# EAGLE design 7seg-micro (EAGLE 7.1.0)
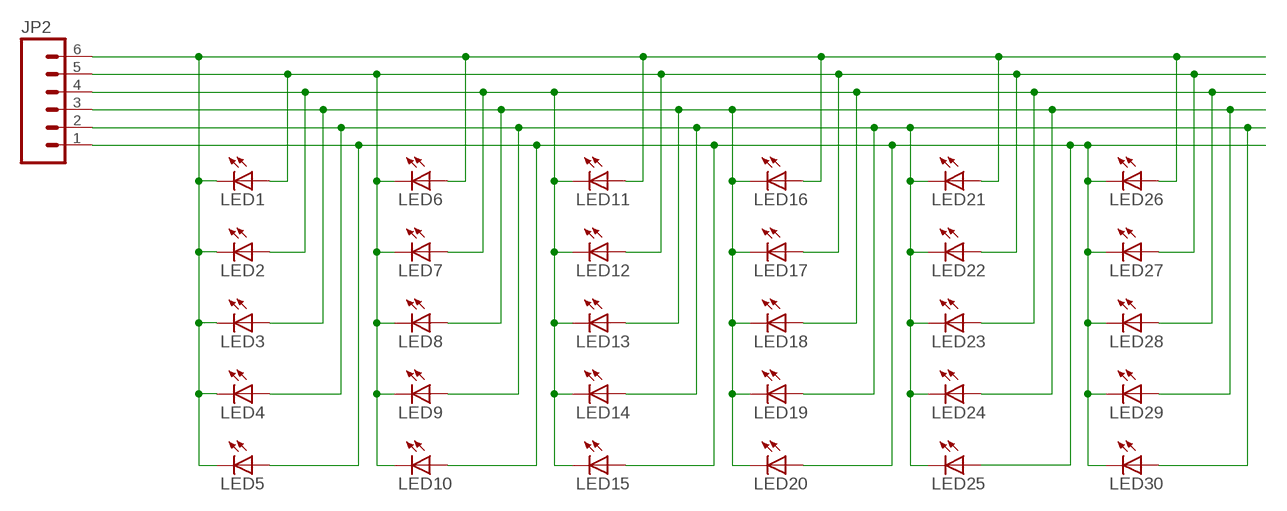
[diagram p0: schematic, sheet 1]

## Parts
JP2  M06NO_SILK_FEMALE_PTH  [1X06_NO_SILK]
LED1  LED0603  [LED-0603]
LED2  LED0603  [LED-0603]
LED3  LED0603  [LED-0603]
LED4  LED0603  [LED-0603]
LED5  LED0603  [LED-0603]
LED6  LED0603  [LED-0603]
LED7  LED0603  [LED-0603]
LED8  LED0603  [LED-0603]
LED9  LED0603  [LED-0603]
LED10  LED0603  [LED-0603]
LED11  LED0603  [LED-0603]
LED12  LED0603  [LED-0603]
LED13  LED0603  [LED-0603]
LED14  LED0603  [LED-0603]
LED15  LED0603  [LED-0603]
LED16  LED0603  [LED-0603]
LED17  LED0603  [LED-0603]
LED18  LED0603  [LED-0603]
LED19  LED0603  [LED-0603]
LED20  LED0603  [LED-0603]
LED21  LED0603  [LED-0603]
LED22  LED0603  [LED-0603]
LED23  LED0603  [LED-0603]
LED24  LED0603  [LED-0603]
LED25  LED0603  [LED-0603]
LED26  LED0603  [LED-0603]
LED27  LED0603  [LED-0603]
LED28  LED0603  [LED-0603]
LED29  LED0603  [LED-0603]
LED30  LED0603  [LED-0603]

## Nets
COL1: JP2.6 LED1.C LED2.C LED3.C LED4.C LED5.C LED6.A LED11.A LED16.A LED21.A LED26.A
COL2: JP2.5 LED1.A LED6.C LED7.C LED8.C LED9.C LED10.C LED12.A LED17.A LED22.A LED27.A
COL3: JP2.4 LED2.A LED7.A LED11.C LED12.C LED13.C LED14.C LED15.C LED18.A LED23.A LED28.A
COL4: JP2.3 LED3.A LED8.A LED13.A LED16.C LED17.C LED18.C LED19.C LED20.C LED24.A LED29.A
COL5: JP2.2 LED4.A LED9.A LED14.A LED19.A LED21.C LED22.C LED23.C LED24.C LED25.C LED30.A
COL6: JP2.1 LED5.A LED10.A LED15.A LED20.A LED25.A LED26.C LED27.C LED28.C LED29.C LED30.C

## Library data of the parts
JP2 = SparkFun-Connectors:M06: Header 6 Standard 6-pin 0.1" header. Use with straight break away headers (SKU : PRT-00116), right angle break away headers (PRT-00553), swiss pins (PRT-00743), machine pins (PRT-00117), and female headers (PRT-00115). Molex polarized connector foot print use with SKU : PRT-08094 with associated crimp pins and housings. NOTES ON THE VARIANTS LOCK and LOCK_LONGPADS... This footprint was designed to help hold the alignment of a through-hole component (i.e. 6-pin header) while soldering it into place. You may notice that each hole has been shifted either up or down by 0.005 of an inch from it's more standard position (which is a perfectly straight line). This slight alteration caused the pins (the squares in the middle) to touch the edges of the holes. Because they are alternating, it causes a "brace" to hold the component in place. 0.005 has proven to be the perfect amount of "off-center" position when using our standard breakaway headers. Although looks a little odd when you look at the bare footprint, once you have a header in there, the alteration is very hard to notice. Also,if you push a header all the way into place, it is covered up entirely on the bottom side. This idea of altering the position of holes to aid alignment will be further integrated into the Sparkfun Library for other footprints. It can help hold any component with 3 or more connection pins.; PROD_ID: CONN-08437
LED1-LED30 = SparkFun:LED: LEDs Standard schematic elements and footprints for 5mm, 3mm, 1206, and 0603 sized LEDs. 5mm - Spark Fun Electronics SKU : COM-00529 (and others)

## Net classes
0 default: width 0.229 mm, drill 0.381 mm, clearance 0.229 mm
1 GND: width 0.279 mm, drill 0.381 mm, clearance 0.279 mm
2 pwr: width 0.254 mm, drill 0.356 mm, clearance 0.254 mm

## Board
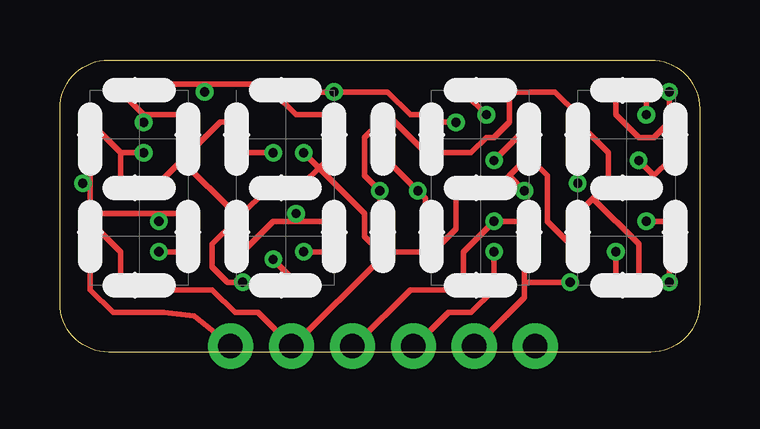
[diagram p1: board, top side]
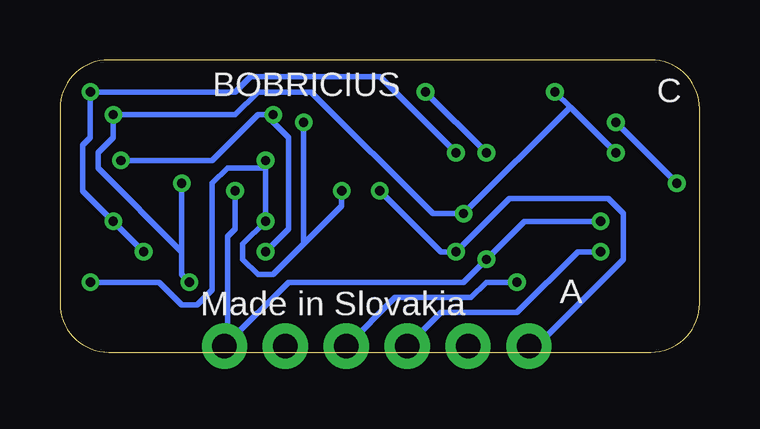
[diagram p2: board, bottom side, seen from below]

Size 26.67 x 12.19 mm. Coordinates in mm from the lower left corner, seen from the top.
Outline: 2.03,12.19 24.64,12.19 arc-90 26.67,10.16 26.67,2.03 arc-90 24.64,0 2.03,0 arc-90 0,2.03 0,10.16 arc-90 2.03,12.19
Copper layers (1*16): Top 0.0356mm / dielectric 1.5011mm / Bottom 0.0356mm
Design rules "LaenPCBOrder *": minimum track width 6mil, minimum drill 13mil, track to track 6mil, track to pad 6mil, pad to pad 6mil, via to via 6mil, smd to smd 6mil, copper to edge 15mil, drill to drill 6mil, minimum pad ring 7mil, minimum via ring 7mil, stop-mask expansion 3mil, vias tented up to drill 100mil, thermal gap 10mil
tRestrict: area -3.8,-10.2 to 44.7,-8.1
bRestrict: area -4.1,-10.2 to 44.5,-8.1

### Footprints (pad centres in the part's own frame; a part is rotated, then mirrored left to right if it is on the bottom)
1X06_NO_SILK = drill 1.016 pad 1.88: 1 0,0; 2 2.54,0; 3 5.08,0; 4 7.62,0; 5 10.16,0; 6 12.7,0
LED-0603 = smd 0.8 x 0.8: A 0,-0.75; C 0,0.75

### Placement (x,y rotation side)
JP2  7.11,0.25 0 top
LED1  3.3,10.92 90 top
LED2  5.33,8.89 0 top
LED3  5.33,4.83 0 top
LED4  3.3,2.79 90 top
LED5  1.27,4.83 0 top
LED6  1.27,8.89 0 top
LED7  3.3,6.86 90 top
LED8  9.4,10.92 90 top
LED9  11.43,8.89 0 top
LED10  11.43,4.83 0 top
LED11  9.4,2.79 90 top
LED12  7.37,4.83 0 top
LED13  7.37,8.89 0 top
LED14  9.4,6.86 90 top
LED15  17.53,10.92 90 top
LED16  19.56,8.89 0 top
LED17  19.56,4.83 0 top
LED18  17.53,2.79 90 top
LED19  15.49,4.83 0 top
LED20  15.49,8.89 0 top
LED21  17.53,6.86 90 top
LED22  23.62,10.92 90 top
LED23  25.65,8.89 0 top
LED24  25.65,4.83 0 top
LED25  23.62,2.79 90 top
LED26  21.59,4.83 0 top
LED27  21.59,8.89 0 top
LED28  23.62,6.86 90 top
LED29  13.46,8.89 0 top
LED30  13.46,4.83 0 top

### Tracks (layer width: path | path; a pad name or v marks a point on that pad's centre or on a via)
COL1  (via drill 0.38)
  Top 0.229: 3.49,9.91 2.86,10.54 2.86,10.86 LED1.C | 3.49,9.91 5.08,9.91 LED2.C | LED4.C 2.54,2.92 2.54,4.19 1.27,5.46 LED5.C 1.27,5.78 | 1.27,5.78 4.13,5.78 | 4.13,5.78 5.08,5.78 LED3.C | 1.27,5.78 1.27,7.05 | 1.27,7.05 LED6.A | v3.49,9.59 3.49,9.91 | 1.27,7.05 v0.95,7.05 | 18.73,7.37 19.37,8 LED16.A 19.69,8 20.32,7.37 20.32,5.46 21.59,4.19 LED26.A | 18.73,7.37 18.42,7.05 LED21.A | v8.89,3.87 9.84,2.92 LED11.A | v19.37,6.73 18.73,7.37 | v4.13,5.46 4.13,5.78
  Bottom 0.229: v0.95,7.05 v3.49,9.59 | 19.69,0.38 17.15,2.92 9.84,2.92 v8.89,3.87 7.3,5.46 v4.13,5.46 | v19.37,6.73 19.37,5.14 19.69,4.83 19.69,0.38 | 19.69,0.38 JP2.6
COL2  (via drill 0.38)
  Top 0.229: 9.84,5.46 11.43,5.46 LED10.C | 9.84,5.46 8.89,5.46 7.62,4.19 LED12.A | 2.54,8.32 2.54,7.05 LED7.C | 2.54,8.32 1.27,9.59 LED6.C | 6.03,11.18 8.57,11.18 LED8.C 8.89,10.86 9.84,9.91 11.43,9.91 LED9.C | 6.03,11.18 4.13,11.18 LED1.A | v3.49,8.32 2.54,8.32 | 6.03,11.18 v6.03,10.86 | v9.84,5.78 9.84,5.46 | 19.37,2.92 19.37,2.29 17.46,0.38 JP2.5 | 19.37,2.92 19.37,3.87 LED17.A | v21.59,7.05 LED27.A | 19.37,2.92 v21.27,2.92 | v24.45,9.91 24.45,10.86 LED22.A
  Bottom 0.229: v6.03,10.86 5.4,10.22 | 5.4,10.22 v3.49,8.32 | 5.4,10.22 v9.84,5.78 11.11,5.78 16.19,10.86 18.42,10.86 19.37,9.91 v24.45,9.91 24.45,8.95 25.08,8.32 25.08,7.68 21.59,4.19 | 21.59,4.19 21.59,3.24 v21.27,2.92 | 21.59,4.19 v21.59,7.05
COL3  (via drill 0.38)
  Top 0.229: LED11.C 8.57,2.92 v7.62,2.92 6.98,2.92 6.35,3.56 6.35,4.51 7.3,5.46 LED12.C | LED14.C 8.57,6.73 7.62,5.78 LED12.C | 5.08,8 4.13,7.05 LED7.A | LED13.C 7.3,9.59 6.67,9.59 5.4,8.32 LED2.A 5.08,8 | 5.08,8 7.3,5.78 LED12.C | JP2.4 14.92,0.38 16.19,1.65 17.15,1.65 18.1,2.6 LED18.A 18.1,2.92 v18.1,4.19 | 24.77,7.37 25.4,8 LED23.A | 24.77,7.37 24.45,7.05 LED28.A | v17.78,9.91 16.83,10.86 LED15.C | 24.77,7.37 v24.13,8
  Bottom 0.229: 18.1,9.91 18.42,9.91 20.32,8 v24.13,8 | v18.1,4.19 17.15,5.14 17.15,8.95 18.1,9.91 | 18.1,9.91 v17.78,9.91 | v7.62,2.92 8.89,2.92 9.53,2.29 12.7,2.29 JP2.4
COL4  (via drill 0.38)
  Top 0.229: v8.89,8.32 7.62,8.32 LED13.A | LED8.A 10.16,10.86 v11.43,10.86 13.65,10.86 14.61,9.91 15.24,9.91 LED20.C 15.56,9.59 v16.51,9.59 | LED19.C 15.24,5.78 15.24,6.41 v14.92,6.73 13.65,8 LED29.A | JP2.3 12.38,0.38 14.61,2.6 16.51,2.6 LED18.C 16.83,2.92 16.83,4.19 v18.1,5.46 19.37,5.46 LED17.C | v4.13,4.19 5.08,4.19 LED3.A | v18.1,8 19.37,9.27 19.37,9.59 LED16.C | v25.4,2.92 25.4,3.87 LED24.A
  Bottom 0.229: v11.43,10.86 v8.89,8.32 | v4.13,4.19 5.08,4.19 7.62,1.65 10.8,1.65 JP2.3 | 18.1,7.68 v18.1,5.46 19.05,4.51 19.05,3.87 18.42,3.24 17.78,3.24 16.51,4.51 | v25.4,2.92 22.54,2.92 21.59,1.97 20.95,1.97 20.32,2.6 20.32,7.05 19.69,7.68 18.1,7.68 | 18.1,7.68 v18.1,8 | v14.92,6.73 14.92,6.1 16.51,4.51 | 16.51,4.51 v16.51,9.59
COL5  (via drill 0.38)
  Top 0.229: LED22.C 23.18,10.86 23.18,9.91 24.13,8.95 24.77,8.95 25.4,9.59 LED23.C 25.4,9.91 v25.4,10.86 | v23.18,4.19 23.18,2.92 LED25.C | v24.45,5.46 25.4,5.46 LED24.C | 10.8,7.68 11.43,8.32 LED9.A | 10.8,7.68 10.16,7.05 LED14.A | LED30.A 13.65,4.19 15.24,4.19 LED19.A 15.56,4.19 16.51,5.14 16.51,6.73 LED21.C | 10.8,7.68 12.7,5.78 12.7,4.83 13.34,4.19 LED30.A | LED4.A 4.13,2.6 6.35,2.6 7.3,1.65 8.26,1.65 JP2.2 9.84,0.38 13.34,3.87 LED30.A | 10.8,7.68 v10.16,8.32
  Bottom 0.229: v23.18,4.19 v24.45,5.46 25.72,6.73 25.72,8.64 25.4,8.95 v25.4,10.86 19.37,10.86 18.73,11.49 13.34,11.49 v10.16,8.32
COL6  (via drill 0.38)
  Top 0.229: LED5.A 1.27,2.6 2.22,1.65 4.32,1.65 5.59,1.52 6.98,0.38 JP2.1 | v10.16,4.19 11.43,4.19 LED10.A | LED30.C 13.34,5.78 v13.34,6.73 12.7,7.37 12.7,8.95 13.34,9.59 LED29.C 13.65,9.91 15.24,8.32 LED20.A 15.56,8.32 17.15,8.32 17.78,8.95 18.1,8.95 18.73,9.59 18.73,10.86 | 22.86,7.05 22.23,6.41 | 22.23,6.41 21.59,5.78 LED26.C | 22.23,6.41 24.13,4.51 24.13,2.92 LED25.A | 22.86,7.05 22.86,8.32 21.59,9.59 LED27.C 21.59,9.91 20.64,10.86 18.73,10.86 | 22.86,7.05 LED28.C | 18.73,10.86 18.42,10.86 LED15.A
  Bottom 0.229: JP2.1 6.98,0.06 3.18,3.87 3.18,5.78 3.81,6.41 7.94,6.41 v10.16,4.19 10.8,4.19 v13.34,6.73

### Text on the board
bNames: C | BOBRICIUS | A | Made in Slovakia